# Altium schematic sheet RS485.SchDoc: =ProjectTitle
size 297 x 209 mm; Address1: Address1; Address2: Address2; Address3: Address3; Address4: Address4; SheetNumber: ?; SheetTotal: ?; Scale: 1:1; DocumentType: Схема электрическая принципиальная
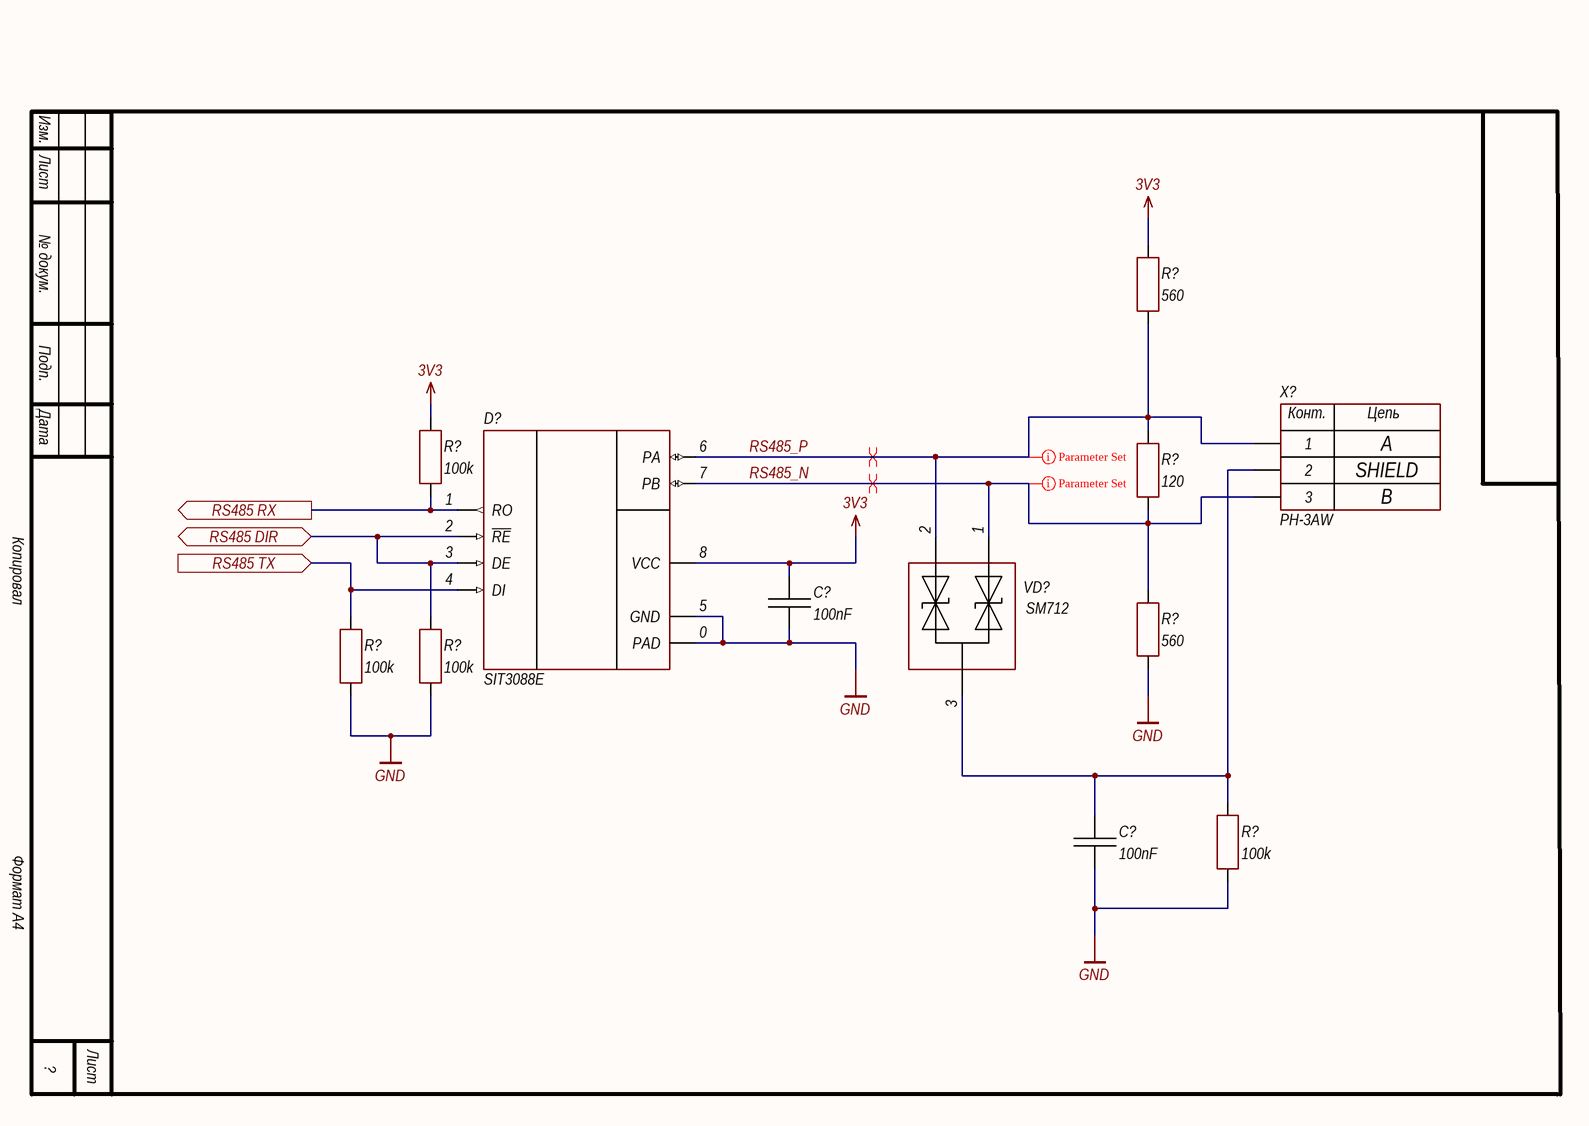
[diagram p0: RS485.SchDoc]

## Parts
(Parts that share a designator on the sheet are numbered #1, #2 ... from top to bottom, then left to right.)
C?#1  100nF  [CH0402C]
C?#2  100nF  [CH0402C]
D?  SIT3088E  [8-DFN (3x3 mm)]
R?#1  560  [CH0402R]
R?#2  100k  [CH0402R]
R?#3  120  [CH0402R]
R?#4  560  [CH0402R]
R?#5  100k  [CH0402R]
R?#6  100k  [CH0402R]
R?#7  100k  [CH0402R]
VD?  SM712  [SOT23_132]
X?  PH-3AW  [CON: PH-3AW]

## Ports
RS485 DIR (bidir), RS485 RX (out), RS485 TX (in)

## Nets
3V3: C?#1.2 D?.8(VCC) R?#1.2 R?#2.2
GND: C?#1.1 C?#2.1 D?.0(PAD) D?.5(GND) R?#4.1 R?#5.1 R?#6.1 R?#7.1
RS485 DIR: D?.2(~{RE}) D?.3(DE) R?#6.2 ; port RS485 DIR
RS485 RX: D?.1(RO) R?#2.1 ; port RS485 RX
RS485 TX: D?.4(DI) R?#5.2 ; port RS485 TX
RS485_N: D?.7(PB) R?#3.1 R?#4.2 VD?.1 X?.3
RS485_P: D?.6(PA) R?#1.1 R?#3.2 VD?.2 X?.1
NetC?#2_2: C?#2.2 R?#7.2 VD?.3 X?.2

## Layout directives
differential pair: RS485_N, RS485_P
rule Matched Net Lengths [Tolerance = 0.05mm]; net class RS485: RS485_N, RS485_P

## Notes on the sheet
- SHIELD
- A
- B
- Изм.
- Лист
- № докум.
- Подп.
- Дата
- Копировал
- Формат А4
- (in symbol 3-Connector) Конт.; Цепь

## Library data of the parts
C?#1 C?#2 = Capacitor: Manufacturer: CCTC; Model: TCC0402X7R104K250AT; HelpURL: https://lcsc.com/product-detail/Multilayer-Ceramic-Capacitors-MLCC-SMD-SMT_CCTC-TCC0402X7R104K250AT_C466234.html; ComponentKind: X7R, 50V; Value: 100nF
D? = SIT3088E: RS485/RS422; Manufacturer: SIT; Model: SIT3088E; HelpURL: https://lcsc.com/product-detail/RS-485-RS-422-ICs_SIT-SIT3088ETK_C601076.html; ComponentKind: 3-5.5V, 1/8
R?#1 R?#4 = Resistor: Manufacturer: Uniroyal Elec; Model: 0402WGF5600TCE; HelpURL: https://lcsc.com/product-detail/Chip-Resistor-Surface-Mount_UNI-ROYAL-Uniroyal-Elec-0402WGF5600TCE_C25126.html; ComponentKind: ±1%; Value: 560
R?#2 R?#5-R?#7 = Resistor: Manufacturer: Uniroyal Elec; Model: 0402WGF1003TCE; HelpURL: https://lcsc.com/product-detail/Chip-Resistor-Surface-Mount_UNI-ROYAL-Uniroyal-Elec-0402WGF1003TCE_C25741.html; ComponentKind: ±1%; Value: 100k
R?#3 = Resistor: Manufacturer: YAGEO; Model: RC0402FR-07120RL; HelpURL: https://lcsc.com/product-detail/Chip-Resistor-Surface-Mount_YAGEO-RC0402FR-07120RL_C114758.html; ComponentKind: ±1%; Value: 120
VD? = TVS Array: Manufacturer: TECH PUBLIC; ComponentKind: 7V/12V, 150W; Model: SM712; HelpURL: https://lcsc.com/product-detail/TVS_TECH-PUBLIC-SM712_C521963.html
X? = 3-Connector: Model: PH-3AW; Manufacturer: *; HelpURL: *; ComponentKind: *